# Altium schematic sheet MCU(64-pin Header).SchDoc: 64-Pin Header (MCU)
size A; DrawnBy: Jeff Scherer; DocumentNumber: 2; Revision: 1; SheetNumber: 2; SheetTotal: 9
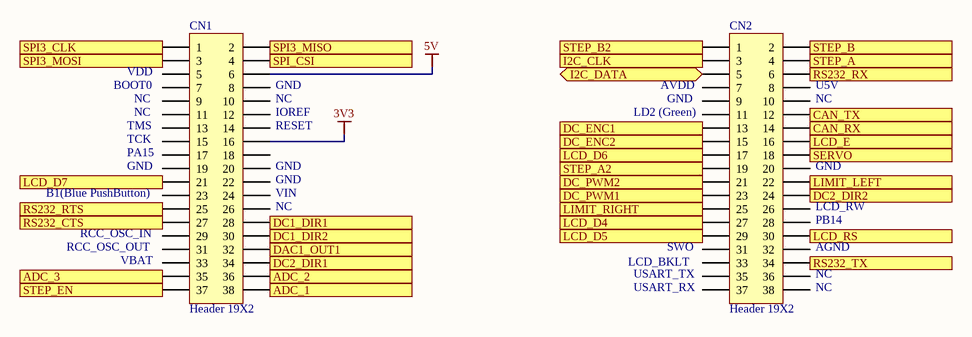
[diagram p0: MCU(64-pin Header).SchDoc]

## Parts
CN1  Header 19X2  [HDR2X19]
CN2  Header 19X2  [HDR2X19]

## Ports
ADC_1 (out), ADC_2 (out), ADC_3 (out), CAN_RX (in), CAN_TX (out), DAC1_OUT1 (out), DC1_DIR1 (out), DC1_DIR2 (out), DC2_DIR1 (out), DC2_DIR2 (out), DC_ENC1 (in), DC_ENC2 (in), DC_PWM1 (out), DC_PWM2 (out), I2C_CLK (out), I2C_DATA (bidir), LCD_D4 (out), LCD_D5 (out), LCD_D6 (out), LCD_D7 (out), LCD_E (out), LCD_RS (out), LIMIT_LEFT (in), LIMIT_RIGHT (in), RS232_CTS (out), RS232_RTS (in), RS232_RX (in), RS232_TX (out), SERVO (out), SPI3_CLK (out), SPI3_MISO (in), SPI3_MOSI (out), SPI_CSI (out), STEP_A2 (out), STEP_A (out), STEP_B2 (out), STEP_B (out), STEP_EN (out)

## Nets
3V3: CN1.16
5V: CN1.6
ADC_1: CN1.38 ; port ADC_1
ADC_2: CN1.36 ; port ADC_2
ADC_3: CN1.35 ; port ADC_3
CAN_RX: CN2.14 ; port CAN_RX
CAN_TX: CN2.12 ; port CAN_TX
DAC1_OUT1: CN1.32 ; port DAC1_OUT1
DC1_DIR1: CN1.28 ; port DC1_DIR1
DC1_DIR2: CN1.30 ; port DC1_DIR2
DC2_DIR1: CN1.34 ; port DC2_DIR1
DC2_DIR2: CN2.24 ; port DC2_DIR2
DC_ENC1: CN2.13 ; port DC_ENC1
DC_ENC2: CN2.15 ; port DC_ENC2
DC_PWM1: CN2.23 ; port DC_PWM1
DC_PWM2: CN2.21 ; port DC_PWM2
I2C_CLK: CN2.3 ; port I2C_CLK
I2C_DATA: CN2.5 ; port I2C_DATA
LCD_D4: CN2.27 ; port LCD_D4
LCD_D5: CN2.29 ; port LCD_D5
LCD_D6: CN2.17 ; port LCD_D6
LCD_D7: CN1.21 ; port LCD_D7
LCD_E: CN2.16 ; port LCD_E
LCD_RS: CN2.30 ; port LCD_RS
LIMIT_LEFT: CN2.22 ; port LIMIT_LEFT
LIMIT_RIGHT: CN2.25 ; port LIMIT_RIGHT
RS232_CTS: CN1.27 ; port RS232_CTS
RS232_RTS: CN1.25 ; port RS232_RTS
RS232_RX: CN2.6 ; port RS232_RX
RS232_TX: CN2.34 ; port RS232_TX
SERVO: CN2.18 ; port SERVO
SPI3_CLK: CN1.1 ; port SPI3_CLK
SPI3_MISO: CN1.2 ; port SPI3_MISO
SPI3_MOSI: CN1.3 ; port SPI3_MOSI
SPI_CSI: CN1.4 ; port SPI_CSI
STEP_A: CN2.4 ; port STEP_A
STEP_A2: CN2.19 ; port STEP_A2
STEP_B: CN2.2 ; port STEP_B
STEP_B2: CN2.1 ; port STEP_B2
STEP_EN: CN1.37 ; port STEP_EN

Not connected (* = marked no-connect by the designer): CN1 5 7 8 9 10 11 12 13 14 15 17 18 19 20 22 23 24 26 29 31 33; CN2 7 8 9 10 11 20 26 28 31 32 33 35 36 37 38

## Notes on the sheet
- (near CN1) BOOT0
- (near CN1) VDD
- (near CN1) GND
- (near CN2) AVDD
- (near CN2) U5V
- (near CN1) TMS
- (near CN1) TCK
- (near CN1) PA15
- (near CN1) NC
- (near CN1) IOREF
- (near CN1) RESET
- (near CN2) LD2 (Green)
- (near CN2) GND
- (near CN2) NC
- (near CN1) B1(Blue PushButton)
- (near CN1) VIN
- (near CN2) PB14
- (near CN2) LCD_RW
- RCC_OSC_OUT
- (near CN1) RCC_OSC_IN
- (near CN1) VBAT
- (near CN2) LCD_BKLT
- (near CN2) USART_TX
- (near CN2) USART_RX
- (near CN2) SWO
- (near CN2) AGND

## Library data of the parts
CN1 CN2 = Header 19X2: Header, 19-Pin, Dual row; Revision: 17-Jul-2002: Re-released for DXP Platform.; Publisher: Altium Limited